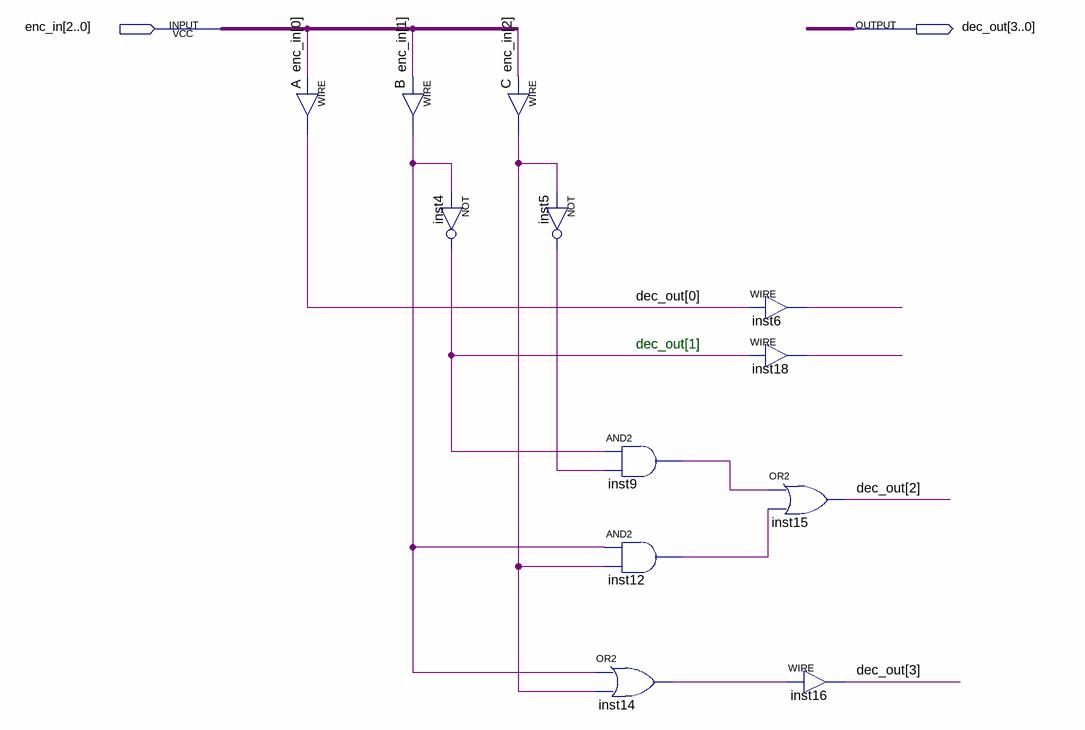
[diagram p0: schematic sheet]
// Quartus schematic sop.bdf as structural Verilog: 12 symbols, 2 pins
module sop (
  input  [2:0] enc_in,
  output [3:0] dec_out
);

  wire B_out, C_out, inst5_out, inst6_out, inst9_out, inst12_out, inst14_out, inst18_out;

  assign dec_out[0] = enc_in[0];  // WIRE A
  assign B_out = enc_in[1];  // WIRE B
  not inst4 (dec_out[1], B_out);
  assign C_out = enc_in[2];  // WIRE C
  not inst5 (inst5_out, C_out);
  and inst9 (inst9_out, dec_out[1], inst5_out);
  and inst12 (inst12_out, B_out, C_out);
  or inst14 (inst14_out, B_out, C_out);
  assign inst6_out = dec_out[0];  // WIRE inst6
  assign inst18_out = dec_out[1];  // WIRE inst18
  or inst15 (dec_out[2], inst9_out, inst12_out);
  assign dec_out[3] = inst14_out;  // WIRE inst16

  // Notes on the sheet:
  //   dec_out[1]
endmodule
